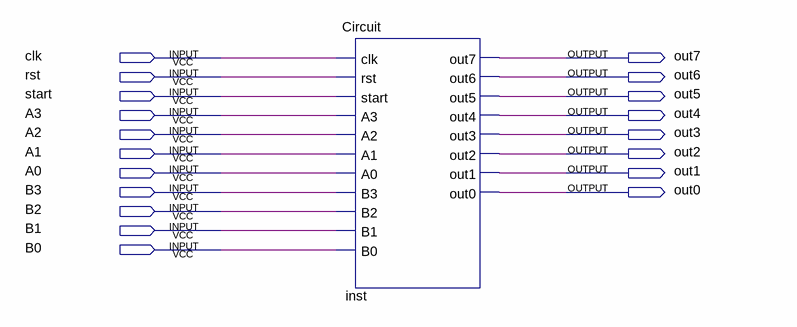
[diagram p0: schematic sheet]
// Quartus schematic CircuitBDF.bdf as structural Verilog: 1 symbols, 19 pins
module CircuitBDF (
  input  clk,
  input  rst,
  input  start,
  input  A3,
  input  A2,
  input  A1,
  input  A0,
  input  B3,
  input  B2,
  input  B1,
  input  B0,
  output out7,
  output out6,
  output out5,
  output out4,
  output out3,
  output out2,
  output out1,
  output out0
);

  Circuit inst (
    .clk(clk), .rst(rst), .start(start), .A3(A3), .A2(A2), .A1(A1), .A0(A0), .B3(B3), .B2(B2), .B1(B1),
    .B0(B0), .out7(out7), .out6(out6), .out5(out5), .out4(out4), .out3(out3), .out2(out2), .out1(out1),
    .out0(out0));
endmodule
